# Altium schematic sheet IR.SchDoc
size A4
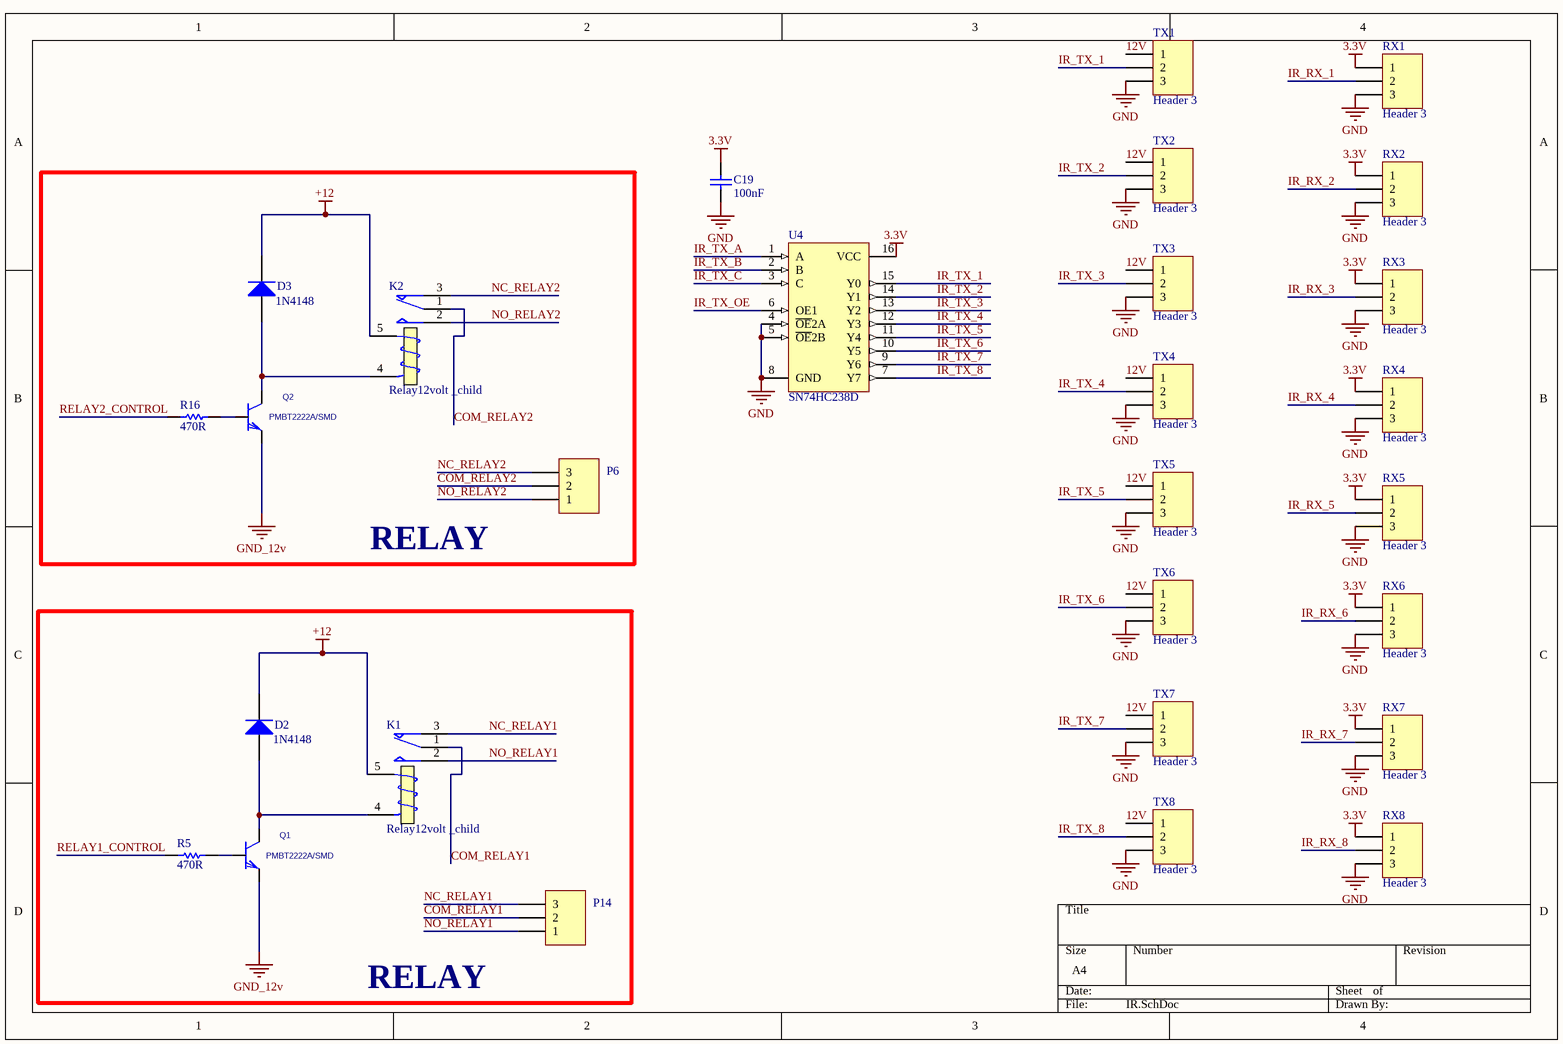
[diagram p0: IR.SchDoc]

## Parts
C19  100nF  [0805]
D2  1N4148  [diode smd]
D3  1N4148  [diode smd]
K1  Relay12volt _child  [relay]
K2  Relay12volt _child  [relay]
P6  kf301/3pin  [Blue Connector 1*3 -kf301]  (value not drawn)
P14  kf301/3pin  [Blue Connector 1*3 -kf301]  (value not drawn)
Q1  PMBT2222A/SMD  [transistoor1]
Q2  PMBT2222A/SMD  [transistoor1]
R5  470R  [res]
R16  470R  [res]
RX1  Header 3  [HDR1X3]
RX2  Header 3  [HDR1X3]
RX3  Header 3  [HDR1X3]
RX4  Header 3  [HDR1X3]
RX5  Header 3  [HDR1X3]
RX6  Header 3  [HDR1X3]
RX7  Header 3  [HDR1X3]
RX8  Header 3  [HDR1X3]
TX1  Header 3  [HDR1X3]
TX2  Header 3  [HDR1X3]
TX3  Header 3  [HDR1X3]
TX4  Header 3  [HDR1X3]
TX5  Header 3  [HDR1X3]
TX6  Header 3  [HDR1X3]
TX7  Header 3  [HDR1X3]
TX8  Header 3  [HDR1X3]
U4  SN74HC238D  [D016_N]

## Blocks framed on the sheet
RELAY: D3 K2 P6 Q2 R16
RELAY: D2 K1 P14 Q1 R5

## Nets
3.3V: C19.1 RX1.1 RX2.1 RX3.1 RX4.1 RX5.1 RX6.1 RX7.1 RX8.1 U4.16(VCC)
+12: D2.2(K) D3.2(K) K1.5 K2.5
GND: C19.2 RX1.3 RX2.3 RX3.3 RX4.3 RX5.3 RX6.3 RX7.3 RX8.3 TX1.3 TX2.3 TX3.3 TX4.3 TX5.3 TX6.3 TX7.3 TX8.3 U4.4(~{OE}2A) U4.5(~{OE}2B) U4.8(GND)
GND_12v: Q1.3(E) Q2.3(E)
12V: TX1.1 TX2.1 TX3.1 TX4.1 TX5.1 TX6.1 TX7.1 TX8.1
COM_RELAY1: K1.1(COM) P14.2
COM_RELAY2: K2.1(COM) P6.2
IR_RX_1: RX1.2
IR_RX_2: RX2.2
IR_RX_3: RX3.2
IR_RX_4: RX4.2
IR_RX_5: RX5.2
IR_RX_6: RX6.2
IR_RX_7: RX7.2
IR_RX_8: RX8.2
IR_TX_1: TX1.2 U4.15(Y0)
IR_TX_2: TX2.2 U4.14(Y1)
IR_TX_3: TX3.2 U4.13(Y2)
IR_TX_4: TX4.2 U4.12(Y3)
IR_TX_5: TX5.2 U4.11(Y4)
IR_TX_6: TX6.2 U4.10(Y5)
IR_TX_7: TX7.2 U4.9(Y6)
IR_TX_8: TX8.2 U4.7(Y7)
IR_TX_A: U4.1(A)
IR_TX_B: U4.2(B)
IR_TX_C: U4.3(C)
IR_TX_OE: U4.6(OE1)
NC_RELAY1: K1.3(T1) P14.3
NC_RELAY2: K2.3(T1) P6.3
NO_RELAY1: K1.2(NO) P14.1
NO_RELAY2: K2.2(NO) P6.1
RELAY1_CONTROL: R5.1
RELAY2_CONTROL: R16.1
NetD2_1: D2.1(A) K1.4(T2) Q1.2(C)
NetD3_1: D3.1(A) K2.4(T2) Q2.2(C)
NetQ1_1: Q1.1(B) R5.2
NetQ2_1: Q2.1(B) R16.2

## Library data of the parts
C19 = Cap: Capacitor; Published: 8-Jun-2000; LatestRevisionDate: 17-Jul-2002; LatestRevisionNote: Re-released for DXP Platform.; PackageReference: RAD-0.3; Publisher: Altium Limited; PackageDescription: Radial Cap, Thru-Hole; 2 Leads; 0.3 in Pin Spacing; Value: 100nF
D2 D3 = Diode 1N4007: 1 Amp General Purpose Rectifier; Published: 8-Jun-2000; LatestRevisionDate: 17-Jul-2002; LatestRevisionNote: Re-released for DXP Platform.; DatasheetVersion: 1998; PackageVersion: Aug-1999; PackageReference: DO-41; Publisher: Altium Limited; PackageDescription: Diode, Axial; Body 5.2 x 2.7 mm (LxDia. max), Lead Dia. 0.86 mm (max); Code_JEDEC: DO-204-AL; ComponentLink1Description: Manufacturer Link; ComponentLink1URL: http://www.fairchildsemi.com/; ComponentLink2Description: Datasheet; ComponentLink2URL: http://www.fairchildsemi.com/ds/1N%2F1N4001.pdf
K1 K2 = Relay: SPDT Relay; Published: 8-Jun-2000; LatestRevisionDate: 17-Jul-2002; LatestRevisionNote: Re-released for DXP Platform.; PackageReference: MODULE5B; Publisher: Altium Limited
P6 P14 = Header 3: LatestRevisionDate: 17-Jul-2002; LatestRevisionNote: Re-released for DXP Platform.; Publisher: Altium Limited
Q1 Q2 = 2N2222A/ZTX: PSpiceTemplate: Q^@REFDES %C %B %E @MODEL ?AREA/@AREA/
R5 R16 = Res1: Resistor; Published: 8-Jun-2000; LatestRevisionDate: 17-Jul-2002; LatestRevisionNote: Re-released for DXP Platform.; PackageReference: AXIAL-0.3; Publisher: Altium Limited; PackageDescription: Axial Device, Thru-Hole; 2 Leads; 0.3 in Pin Spacing; Value: 470R
RX1-RX8 TX1-TX8 = Header 3: Header, 3-Pin; LatestRevisionDate: 17-Jul-2002; LatestRevisionNote: Re-released for DXP Platform.; Publisher: Altium Limited
U4 = SN74HC238D: 3-Line to 8-Line Decoder / Demultiplexer; Published: 8-Jun-2000; LatestRevisionDate: 13-Apr-2006; LatestRevisionNote: IPC-7351 Footprint Added.; DatasheetVersion: Jun-1989; PackageVersion: Jan-1998; PackageReference: D016; Publisher: Altium Limited; PackageDescription: 16-Pin Small Outline Integrated Circuit 1.27 mm Pitch; Code_IPC: SOIC127P600-16; ComponentLink1Description: Manufacturer Link; ComponentLink1URL: http://www.ti.com/